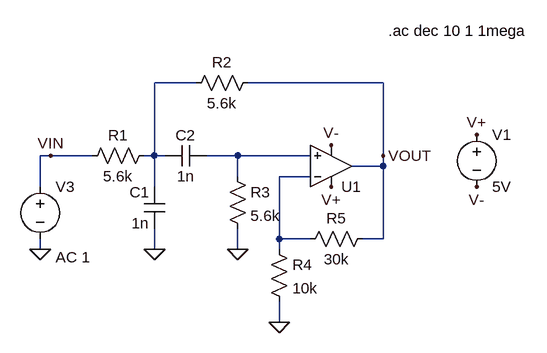
[diagram p0: schematic ELEC2_BP_Active_NoValues.asc]
ELEC2_BP_Active_NoValues.asc, the LTspice schematic file:
Version 4.1
SHEET 1 880 680
WIRE 32 -16 -32 -16
WIRE 320 -16 112 -16
WIRE -192 96 -208 96
WIRE -128 96 -192 96
WIRE -32 96 -32 -16
WIRE -32 96 -48 96
WIRE -16 96 -32 96
WIRE 96 96 48 96
WIRE 208 96 96 96
WIRE 320 96 320 -16
WIRE 320 112 320 96
WIRE 320 112 272 112
WIRE 96 128 96 96
WIRE 208 128 160 128
WIRE -208 144 -208 96
WIRE -32 144 -32 96
WIRE 160 224 160 128
WIRE 208 224 160 224
WIRE 320 224 320 112
WIRE 320 224 288 224
WIRE -208 240 -208 224
WIRE -32 240 -32 208
WIRE 96 240 96 208
WIRE 160 240 160 224
WIRE 160 352 160 320
FLAG 464 64 V+
FLAG 240 144 V+
FLAG -208 240 0
FLAG 240 80 V-
FLAG 320 96 VOUT
FLAG -192 96 VIN
FLAG 464 144 V-
FLAG -32 240 0
FLAG 96 240 0
FLAG 160 352 0
SYMBOL voltage 464 48 R0
SYMATTR InstName V1
SYMATTR Value 5V
SYMBOL voltage -208 128 R0
WINDOW 3 24 152 Left 2
WINDOW 123 24 124 Left 2
WINDOW 39 0 0 Left 0
SYMATTR Value ""
SYMATTR Value2 AC 1
SYMATTR InstName V3
SYMBOL cap -16 208 R180
WINDOW 0 24 56 Left 2
WINDOW 3 24 8 Left 2
SYMATTR InstName C1
SYMATTR Value 1n
SYMBOL cap 48 80 R90
WINDOW 0 0 32 VBottom 2
WINDOW 3 32 32 VTop 2
SYMATTR InstName C2
SYMATTR Value 1n
SYMBOL res -32 80 R90
WINDOW 0 0 56 VBottom 2
WINDOW 3 32 56 VTop 2
SYMATTR InstName R1
SYMATTR Value 5.6k
SYMBOL res 128 -32 R90
WINDOW 0 0 56 VBottom 2
WINDOW 3 32 56 VTop 2
SYMATTR InstName R2
SYMATTR Value 5.6k
SYMBOL res 80 112 R0
SYMATTR InstName R3
SYMATTR Value 5.6k
SYMBOL res 144 224 R0
SYMATTR InstName R4
SYMATTR Value 10k
SYMBOL res 304 208 R90
WINDOW 0 0 56 VBottom 2
WINDOW 3 32 56 VTop 2
SYMATTR InstName R5
SYMATTR Value 30k
SYMBOL OpAmps\\UniversalOpAmp 240 112 M180
SYMATTR InstName U1
TEXT 328 -96 Left 2 !.ac dec 10 1 1mega

The netlist it stands for:
* ELEC2_BP_Active_NoValues.asc
V1 V+ V- 5V
V3 VIN 0 AC 1
C1 0 N001 1n
C2 N002 N001 1n
R1 N001 VIN 5.6k
R2 VOUT N001 5.6k
R3 N002 0 5.6k
R4 N003 0 10k
R5 VOUT N003 30k
X§U1 N002 N003 V+ V- VOUT level1 Avol=1Meg GBW=10Meg Vos=0 En=0 Enk=0 In=0 Ink=0 Rin=500Meg  ; pins In+ In- V+ V- OUT
.ac dec 10 1 1mega
.lib UniversalOpAmp1.lib
.backanno
.end